# EAGLE design USB_Watt_Meter (EAGLE 5.11)
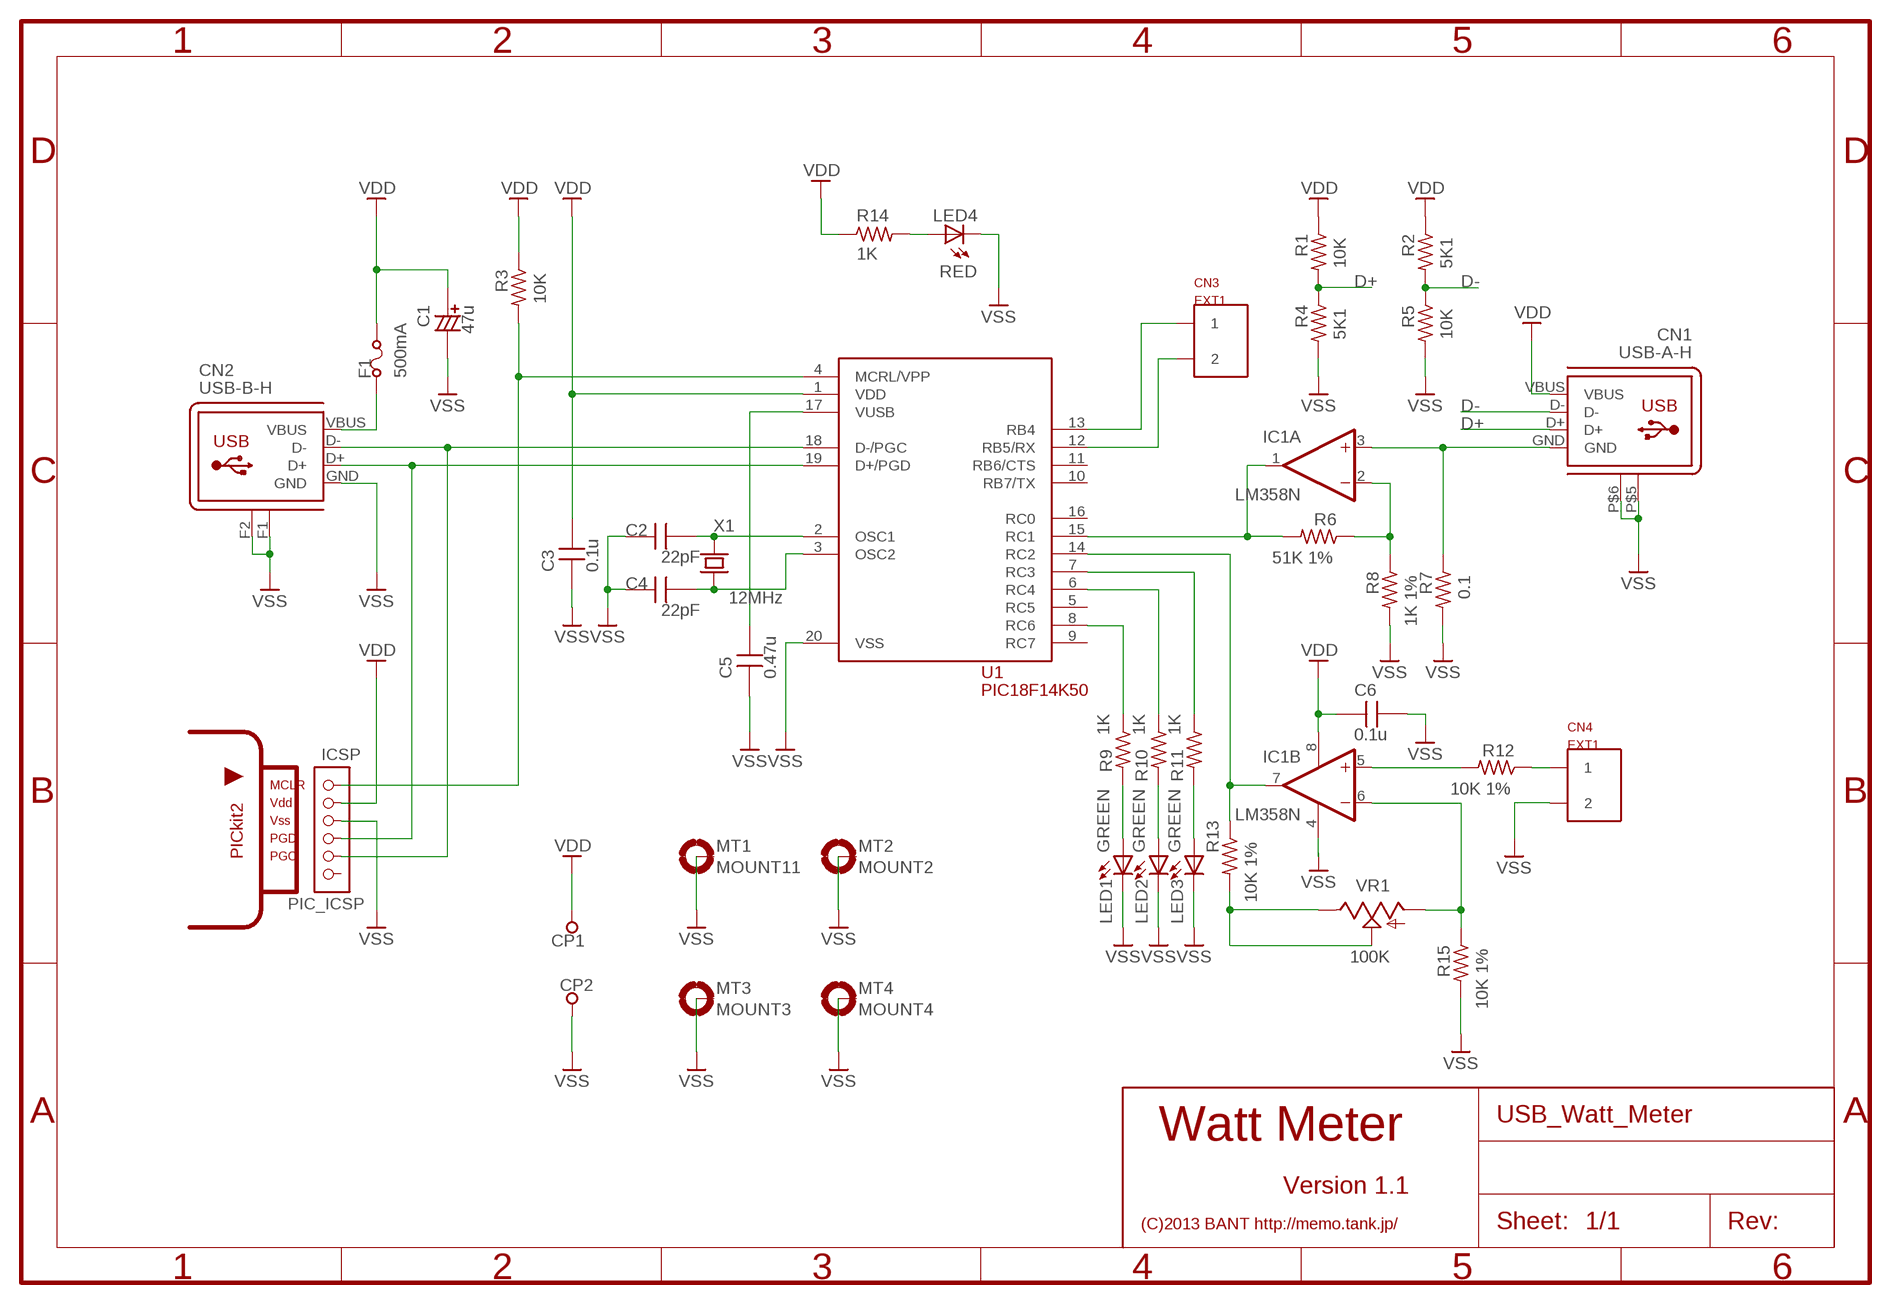
[diagram p0: schematic, sheet 1]

## Parts
C1  47u  CCAP6.5  [CCAP_6.5]
C2  22pF  CAPDIP_2  [CAP_DIP_2]
C3  0.1u  CAPDIP_2  [CAP_DIP_2]
C4  22pF  CAPDIP_2  [CAP_DIP_2]
C5  0.47u  CAPDIP_2  [CAP_DIP_2]
C6  0.1u  CAPDIP_1  [CAP_DIP_1]
CN1  USB-A-H  [USB-A-H]
CN2  USB-B-H  [USB-B-H]
CN3  EXT1  TERMINAL  [TERMINAL]
CN4  EXT1  TERMINAL  [TERMINAL]
CP1  TP1R  [TP1]
CP2  TP1R  [TP1]
F1  500mA  POLYSW-N/200  [F-N/200]
IC1  LM358N  [DIL08]
ICSP  PIC_ICSP  [PIC_ICSP]
LED1  GREEN  LED3MM  [LED3MM]
LED2  GREEN  LED3MM  [LED3MM]
LED3  GREEN  LED3MM  [LED3MM]
LED4  RED  LED3MM  [LED3MM]
MT1  MOUNT11  MOUNT-PAD2.1  [PAD-2.1]
MT2  MOUNT2  MOUNT-PAD2.1  [PAD-2.1]
MT3  MOUNT3  MOUNT-PAD2.1  [PAD-2.1]
MT4  MOUNT4  MOUNT-PAD2.1  [PAD-2.1]
R1  10K  R0.125W_4P  [R_0.125W_4]
R2  5K1  R0.125W_4P  [R_0.125W_4]
R3  10K  R0.125W_4P  [R_0.125W_4]
R4  5K1  R0.125W_4P  [R_0.125W_4]
R5  10K  R0.125W_4P  [R_0.125W_4]
R6  51K 1%  R0.125W_4P  [R_0.125W_4]
R7  0.1  R1W_6  [R_1W_6]
R8  1K 1%  R0.125W_4P  [R_0.125W_4]
R9  1K  R0.125W_4P  [R_0.125W_4]
R10  1K  R0.125W_4P  [R_0.125W_4]
R11  1K  R0.125W_4P  [R_0.125W_4]
R12  10K 1%  R0.125W_4P  [R_0.125W_4]
R13  10K 1%  R0.125W_4P  [R_0.125W_4]
R14  1K  R0.125W_4P  [R_0.125W_4]
R15  10K 1%  R0.125W_4P  [R_0.125W_4]
U1  PIC18F14K50  [DIL20]
VR1  100K  POTSMALL  [POT_B25P]
X1  12MHz  XTAL49S  [HC49/S]

## Nets
D+: CN1.D+ R1.2 R4.1
D-: CN1.D- R2.2 R5.1
N$1: C5.2 U1.17(VUSB)
N$2: CN2.VBUS F1.2
N$3: C2.2 U1.2(OSC1) X1.2
N$4: CN2.D+ ICSP.PGD U1.19(D+/PGD)
N$5: C4.2 U1.3(OSC2) X1.1
N$6: IC1.2(A:-IN) R6.1 R8.1
N$7: IC1.6(B:-IN) R15.1 VR1.A
N$8: CN1.GND IC1.3(A:+IN) R7.1
N$9: IC1.1(A:OUT) R6.2 U1.15(RC1)
N$10: IC1.5(B:+IN) R12.2
N$11: CN4.P$1 R12.1
N$12: IC1.7(B:OUT) R13.1 U1.14(RC2)
N$13: R10.1 U1.6(RC4)
N$14: R13.2 VR1.E VR1.S
N$15: CN2.D- ICSP.PGC U1.18(D-/PGC)
N$16: R9.1 U1.8(RC6)
N$17: ICSP.MCLR R3.2 U1.4(MCRL/VPP)
N$19: LED2.A R10.2
N$21: LED1.A R9.2
N$22: R11.1 U1.7(RC3)
N$23: LED3.A R11.2
N$24: CN3.P$1 U1.13(RB4)
N$25: CN3.P$2 U1.12(RB5/RX)
N$27: LED4.A R14.2
VDD: C1.+ C3.2 C6.1 CN1.VBUS CP1.P$1 F1.1 IC1.8(P:V+) ICSP.VDD R1.1 R2.1 R3.1 R14.1 U1.1(VDD)
VSS: C1.- C2.1 C3.1 C4.1 C5.1 C6.2 CN1.P$5(S1) CN1.P$6(S2) CN2.F1(S2) CN2.F2(S1) CN2.GND CN4.P$2 CP2.P$1 IC1.4(P:V-) ICSP.VSS LED1.K(C) LED2.K(C) LED3.K(C) LED4.K(C) MT1.B2,1(MOUNT) MT2.B2,1(MOUNT) MT3.B2,1(MOUNT) MT4.B2,1(MOUNT) R4.2 R5.2 R7.2 R8.2 R15.2 U1.20(VSS)
Unconnected: ICSP.NC U1.5(RC5) U1.9(RC7) U1.10(RB7/TX) U1.11(RB6/CTS) U1.16(RC0)

## Notes on the sheet
- Watt Meter
- Version 1.1
- (C)2013 BANT http://memo.tank.jp/

## Library data of the parts
C1 = MyLib:CCAP: Polar capacitor
C2-C6 = MyLib:CAP: Non polar capacitor
CN1 CN2 = con-usb2:USB: OMRON - USB Connectors
CN3 CN4 = bant:TERMINAL
CP1 CP2 = MyLib:TP1: 1 Pin Test Point
F1 = MyLib:POLYSW
IC1 = linear4:LM358: OP AMP
ICSP = 001mylib:PIC_ICSP
LED1-LED4 = led:LED: LED OSRAM: - CHIPLED LG R971, LG N971, LY N971, LG Q971, LY Q971, LO R971, LY R971 LH N974, LH R974 LS Q976, LO Q976, LY Q976 LO Q996 - Hyper CHIPLED LW Q18S LB Q993, LB Q99A, LB R99A - SideLED LS A670, LO A670, LY A670, LG A670, LP A670 LB A673, LV A673, LT A673, LW A673 LH A674 LY A675 LS A676, LA A676, LO A676, LY A676, LW A676 LS A679, LY A679, LG A679 - Hyper Micro SIDELED® LS Y876, LA Y876, LO Y876, LY Y876 LT Y87S - SmartLED LW L88C, LW L88S LB L89C, LB L89S, LG L890 LS L89K, LO L89K, LY L89K LS L896, LA L896, LO L896, LY L896 - TOPLED LS T670, LO T670, LY T670, LG T670, LP T670 LSG T670, LSP T670, LSY T670, LOP T670, LYG T670 LG T671, LOG T671, LSG T671 LB T673, LV T673, LT T673, LW T673 LH T674 LS T676, LA T676, LO T676, LY T676, LB T676, LH T676, LSB T676, LW T676 LB T67C, LV T67C, LT T67C, LS T67K, LO T67K, LY T67K, LW E67C LS E67B, LA E67B, LO E67B, LY E67B, LB E67C, LV E67C, LT E67C LW T67C LS T679, LY T679, LG T679 LS T770, LO T770, LY T770, LG T770, LP T770 LB T773, LV T773, LT T773, LW T773 LH T774 LS E675, LA E675, LY E675, LS T675 LS T776, LA T776, LO T776, LY T776, LB T776 LHGB T686 LT T68C, LB T68C - Hyper Mini TOPLED® LB M676 - Mini TOPLED Santana® LG M470 LS M47K, LO M47K, LY M47K Source: http://www.osram.convergy.de LUXEON: - LUMILED® LXK2-PW12-R00, LXK2-PW12-S00, LXK2-PW14-U00, LXK2-PW14-V00 LXK2-PM12-R00, LXK2-PM12-S00, LXK2-PM14-U00 LXK2-PE12-Q00, LXK2-PE12-R00, LXK2-PE12-S00, LXK2-PE14-T00, LXK2-PE14-U00 LXK2-PB12-K00, LXK2-PB12-L00, LXK2-PB12-M00, LXK2-PB14-N00, LXK2-PB14-P00, LXK2-PB14-Q00 LXK2-PR12-L00, LXK2-PR12-M00, LXK2-PR14-Q00, LXK2-PR14-R00 LXK2-PD12-Q00, LXK2-PD12-R00, LXK2-PD12-S00 LXK2-PH12-R00, LXK2-PH12-S00 LXK2-PL12-P00, LXK2-PL12-Q00, LXK2-PL12-R00 Source: www.luxeon.com KINGBRIGHT: KA-3528ASYC Source: www.kingbright.com
MT1-MT4 = MyLib:MOUNT-PAD: 2.1mm Mount Pad (Connectable to GND)
R1-R15 = MyLib:R: General Resiter 1/8W 1/4W 1/2W V/H
U1 = bant:PIC18F14K50
VR1 = MyLib:POT: Volume Trimmer Resister
X1 = Xtal:XTAL: Crystal Oscillator HC49U/S

## Board
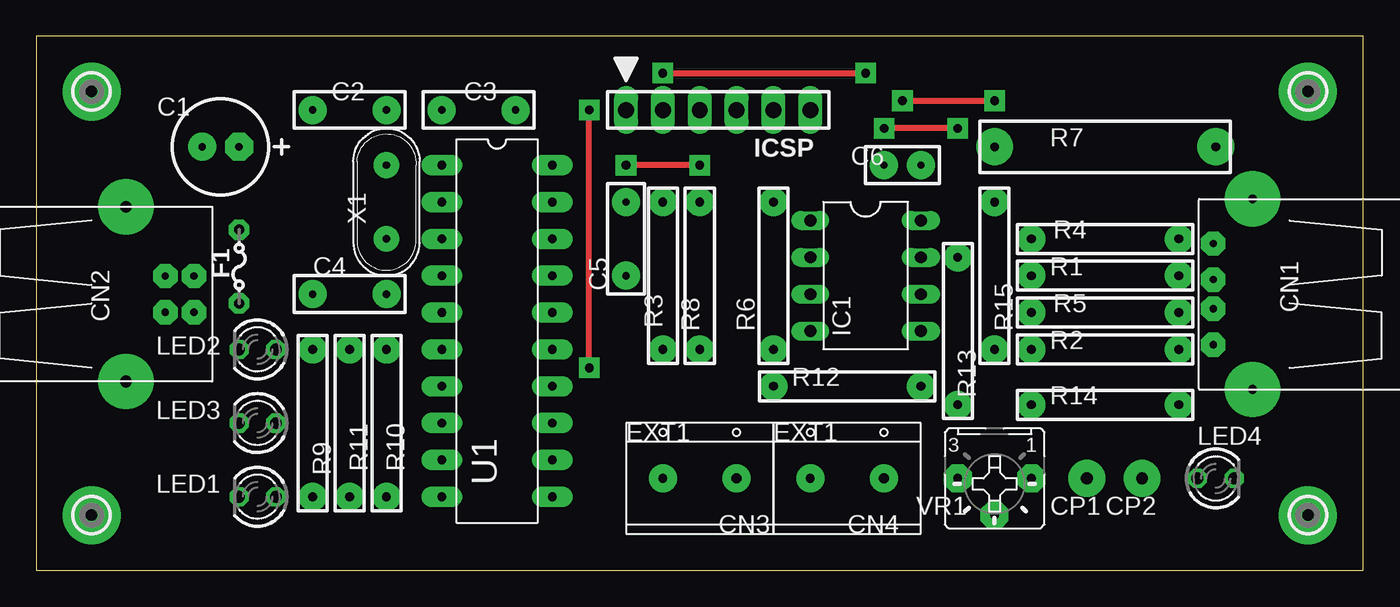
[diagram p1: board, top side]
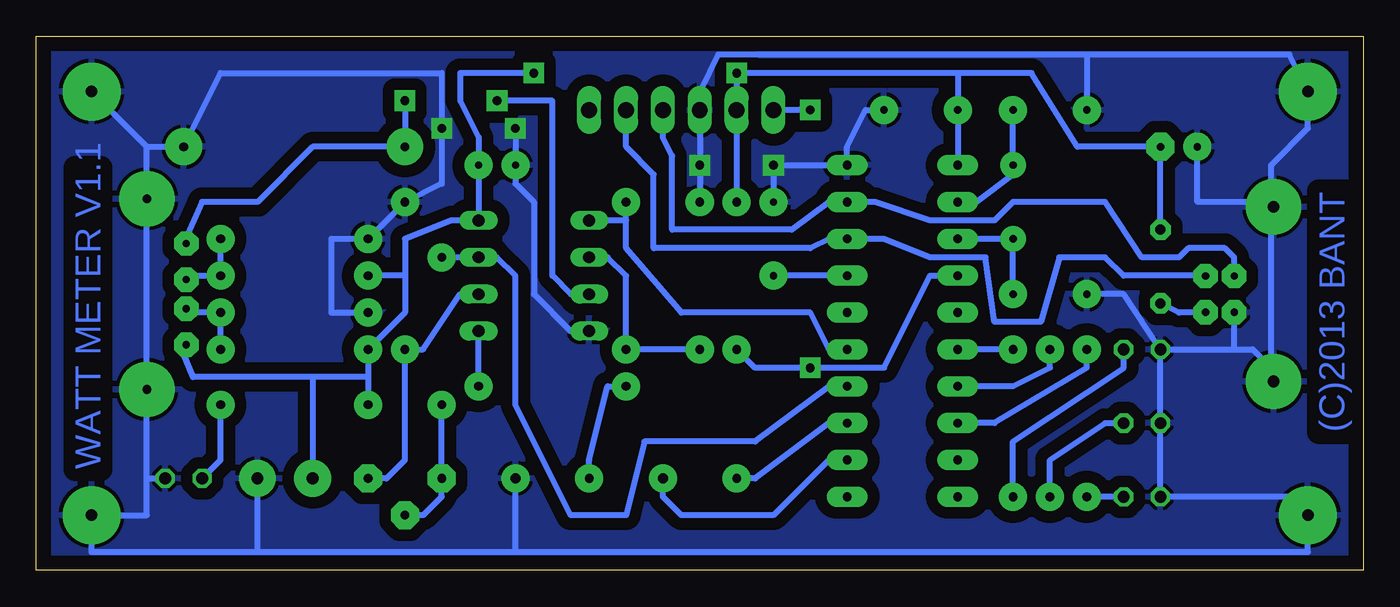
[diagram p2: board, bottom side, seen from below]

Size 91.44 x 36.83 mm. Coordinates in mm from the lower left corner, seen from the top.
Outline: 0,0 91.44,0 91.44,36.83 0,36.83 0,0
Copper layers (1*16): Top 0.035mm / dielectric 1.5mm / Bottom 0.035mm
Design rules "default": minimum track width 10mil, minimum drill 24mil, track to track 8mil, track to pad 8mil, pad to pad 8mil, via to via 8mil, smd to smd 8mil, copper to edge 40mil, drill to drill 8mil, minimum pad ring 10mil, minimum via ring 8mil, stop-mask expansion 4mil, vias tented up to drill 0mil, thermal gap 10mil

### Footprints (pad centres in the part's own frame; a part is rotated, then mirrored left to right if it is on the bottom)
CCAP_6.5 = drill 0.5 pad 1.93 octagon: + -1.27,0 | drill 0.5 pad 1.93 round: - 1.27,0
CAP_DIP_2 = drill 0.5 pad 1.93 round: 1 -2.54,0; 2 2.54,0
CAP_DIP_1 = drill 0.5 pad 1.93 round: 1 -1.27,0; 2 1.27,0
USB-A-H = drill 0.5 pad 1.676 octagon: D+ 2.718,-1.003; D- 2.718,1.003; GND 2.718,-3.493; VBUS 2.718,3.493 | drill 0.6 pad 3.81 round: P$5 0,-6.566; P$6 0,6.566
USB-B-H = drill 0.5 pad 1.676 octagon: D+ 0,1.25; D- 1.981,1.25; GND 0,-1.25; VBUS 1.981,-1.25 | drill 0.8 pad 3.81 round: F1 -2.718,6.02; F2 -2.718,-6.02
TERMINAL = drill 0.6 pad 1.93 round: P$1 -2.54,0 | drill 0.7 pad 1.93 round: P$2 2.54,0
TP1 = drill 0.813 pad 2.54 round: P$1 0,0
F-N/200 = drill 0.7 pad 1.422 octagon: 1 -2.54,0; 2 2.54,0
DIL08 = drill 0.813 long: 1 -3.81,-3.81; 2 -1.27,-3.81; 3 1.27,-3.81; 4 3.81,-3.81; 5 3.81,3.81; 6 1.27,3.81; 7 -1.27,3.81; 8 -3.81,3.81
PIC_ICSP = drill 1.1 long: MCLR -6.35,0; NC 6.35,0; PGC 3.81,0; PGD 1.27,0; VDD -3.81,0; VSS -1.27,0
LED3MM = drill 0.813 octagon: A -1.27,0; K 1.27,0
PAD-2.1 = drill 0.8 pad 4 round: B2,1 0,0
R_0.125W_4 = drill 0.6 pad 1.93 round: 1 -5.08,0; 2 5.08,0
R_1W_6 = drill 0.6 pad 2.54 round: 1 -7.62,0; 2 7.62,0
DIL20 = drill 0.6 pad 1.422 long: 1 -11.43,-3.81; 2 -8.89,-3.81; 3 -6.35,-3.81; 4 -3.81,-3.81; 5 -1.27,-3.81; 6 1.27,-3.81; 7 3.81,-3.81; 8 6.35,-3.81; 9 8.89,-3.81; 10 11.43,-3.81; 11 11.43,3.81; 12 8.89,3.81; 13 6.35,3.81; 14 3.81,3.81; 15 1.27,3.81; 16 -1.27,3.81; 17 -3.81,3.81; 18 -6.35,3.81; 19 -8.89,3.81; 20 -11.43,3.81
POT_B25P = drill 0.6 pad 1.93 octagon: A -2.54,0; E 2.54,0; S 0,2.54
HC49/S = drill 0.5 pad 1.778 round: 1 -2.54,0; 2 2.54,0

### Placement (x,y rotation side)
C1  12.7,29.21 180 top
C2  21.59,31.75 0 top
C3  30.48,31.75 180 top
C4  21.59,19.05 0 top
C5  40.64,22.86 270 top
C6  59.69,27.94 180 top
CN1  83.82,19.05 180 top
CN2  8.89,19.05 0 top
CN3  45.72,6.35 0 top
CN4  55.88,6.35 0 top
CP1  72.39,6.35 0 top
CP2  76.2,6.35 0 top
F1  13.97,20.95 270 top
IC1  57.15,20.32 270 top
ICSP  46.99,31.75 0 top
LED1  15.24,5.08 180 top
LED2  15.24,15.24 180 top
LED3  15.24,10.16 180 top
LED4  81.28,6.35 0 top
MT1  3.81,3.81 0 top
MT2  87.63,3.81 90 top
MT3  3.81,33.02 0 top
MT4  87.63,33.02 0 top
R1  73.66,20.32 0 top
R2  73.66,15.24 0 top
R3  43.18,20.32 270 top
R4  73.66,22.86 180 top
R5  73.66,17.78 180 top
R6  50.8,20.32 90 top
R7  73.66,29.21 0 top
R8  45.72,20.32 90 top
R9  19.05,10.16 270 top
R10  24.13,10.16 270 top
R11  21.59,10.16 270 top
R12  55.88,12.7 0 top
R13  63.5,16.51 270 top
R14  73.66,11.43 0 top
R15  66.04,20.32 90 top
U1  31.75,16.51 270 top
VR1  66.04,6.35 180 top
X1  24.13,25.4 90 top

### Tracks (layer width: path | path; a pad name or v marks a point on that pad's centre or on a via)
D+
  Bottom 0.406: CN1.D+ 81.28,20.32 R1.2 R4.1
D-
  Bottom 0.406: CN1.D- 81.28,17.78 R5.1 R2.2
N$1
  Bottom 0.406: U1.17 C5.2
N$2
  Bottom 0.406: F1.2 12.7,17.78 11.43,17.78 CN2.VBUS
N$3
  Bottom 0.406: U1.2 26.67,25.4 24.13,27.3 X1.2 C2.2
N$4
  Bottom 0.406: CN2.D+ 8.89,21.59 9.53,22.23 12.06,22.23 12.7,21.59 15.24,21.59 17.78,25.4 24.13,25.4 25.4,24.13 29.84,24.13 33.66,25.4 U1.19 36.83,25.4 39.37,23.5 47.62,23.5 47.62,28.57 48.26,29.84 ICSP.PGD
N$5
  Bottom 0.406: U1.3 X1.1 C4.2
N$6
  Bottom 0.406: IC1.2 52.07,21.59 50.8,20.32 R6.1 R8.1
N$7
  Bottom 0.406: IC1.6 62.23,19.05 64.77,15.24 R15.1 66.04,7.62 67.31,6.35 VR1.A
N$8  (via drill 0.6 pad 1.42)
  Top 0.406: v59.69,32.38 v66.04,32.38
  Bottom 0.406: CN1.GND 81.28,22.54 80.01,25.4 76.2,25.4 72.39,29.21 R7.1 v66.04,32.38 | IC1.3 54.61,19.05 55.88,20.32 55.88,32.38 v59.69,32.38
N$9
  Bottom 0.406: U1.15 36.83,15.24 38.1,17.78 46.99,17.78 50.8,22.23 50.8,24.13 | 50.8,24.13 R6.2 | 50.8,24.13 IC1.1
N$10
  Bottom 0.406: R12.2 IC1.5
N$11
  Bottom 0.406: CN4.P$1 53.34,7.62 52.07,12.7 R12.1
N$12
  Bottom 0.406: R13.1 IC1.7 59.69,21.59 58.42,20.32 58.42,11.43 54.61,3.81 50.8,3.81 49.53,8.89 41.91,8.89 36.83,12.7 U1.14
N$13
  Bottom 0.406: R10.1 U1.6
N$14
  Bottom 0.406: R13.2 VR1.E 63.5,5.08 64.77,3.81 VR1.S
N$15
  Bottom 0.406: ICSP.PGC 50.8,29.21 48.9,27.3 48.9,22.23 38.1,22.23 36.83,22.86 U1.18 33.02,22.86 29.84,21.59 26.04,21.59 25.4,17.14 22.23,17.14 20.95,21.59 17.78,21.59 16.51,20.32 10.87,20.32 CN2.D-
N$16
  Bottom 0.406: U1.8 25.4,10.16 19.05,13.97 R9.1
N$17  (via drill 0.6 pad 1.42)
  Top 0.406: v38.1,13.97 v38.1,31.75
  Bottom 0.406: U1.4 29.84,20.32 33.02,13.97 v38.1,13.97 41.91,13.97 R3.2 | v38.1,31.75 ICSP.MCLR
N$19
  Bottom 0.406: LED2.A 16.51,13.97 24.13,8.89 R10.2
N$21
  Bottom 0.406: LED1.A R9.2
N$22
  Bottom 0.406: U1.7 24.13,12.7 21.59,13.97 R11.1
N$23
  Bottom 0.406: R11.2 21.59,7.62 17.78,10.16 LED3.A
N$24
  Bottom 0.406: U1.13 36.83,10.16 41.91,6.35 CN3.P$1
N$25
  Bottom 0.406: U1.12 36.83,7.62 40.64,3.81 46.99,3.81 48.26,5.08 CN3.P$2
N$27
  Bottom 0.406: R14.2 78.74,7.62 LED4.A
VDD  (via drill 0.6 pad 1.42)
  Top 0.406: v43.18,34.29 v57.15,34.29
  Bottom 0.406: 68.58,13.34 R14.1 | U1.1 C3.2 27.94,34.29 | R3.1 ICSP.VDD v43.18,34.29 27.94,34.29 | 27.94,34.29 22.86,34.29 19.68,29.21 C1.+ F1.1 | 66.04,20.32 66.04,22.86 62.87,24.13 IC1.8 C6.1 60.96,29.84 62.23,32.38 62.23,34.29 v57.15,34.29 | 66.04,20.32 66.04,17.78 R2.1 68.58,13.34 | 66.04,20.32 R1.1 | CN1.VBUS 81.28,14.92 80.64,13.34 72.39,13.34 | 72.39,13.34 CP1.P$1 | 68.58,13.34 72.39,13.34
VSS  (via drill 0.6 pad 1.42)
  Top 0.406: v45.72,27.94 v40.64,27.94 | v63.5,30.48 v58.42,30.48
  Bottom 0.254: CN2.GND 8.89,17.78 | CN2.F1 6.35,25.4
  Bottom 0.406: 19.05,35.56 44.45,35.56 45.72,33.02 ICSP.VSS v45.72,27.94 R8.2 | 19.05,35.56 C2.1 | LED2.K LED3.K LED1.K 5.08,5.08 MT1.B2,1 3.81,1.27 58.42,1.27 | C4.1 16.51,19.05 LED2.K | 8.89,15.24 CN2.GND | LED2.K 8.89,15.24 | R5.2 71.12,17.78 71.12,22.86 R4.2 R15.2 63.5,26.67 v63.5,30.48 63.5,34.29 78.74,34.29 R7.2 83.82,29.21 | 83.82,29.21 MT4.B2,1 | C3.1 34.29,31.75 35.56,29.21 U1.20 v40.64,27.94 C5.1 | 83.82,29.21 CN1.P$5 CN1.P$6 83.82,6.35 | 6.35,13.97 7.62,15.24 8.89,15.24 | 6.35,13.97 CN2.F2 | 6.35,13.97 6.35,25.07 CN2.F1 6.17,25.4 11.43,25.4 C1.- | 19.05,35.56 5.08,35.56 MT3.B2,1 3.81,30.48 6.35,27.94 6.35,25.4 | 58.42,1.27 76.2,1.27 | 58.42,1.27 CN4.P$2 | 76.2,1.27 CP2.P$1 | 76.2,1.27 87.63,1.27 MT2.B2,1 83.82,3.81 83.82,6.35 | 83.82,6.35 LED4.K | IC1.4 54.61,16.51 57.15,19.05 57.15,25.4 58.42,26.67 C6.2 v58.42,30.48
  pour Bottom (isolate 0.813): 0,36.83 0,0 91.44,0 91.44,36.83

### Text on the board
Bottom: (C)2013 BANT | WATT METER V1.1